# EAGLE design Load Switch (EAGLE 9.4.2)
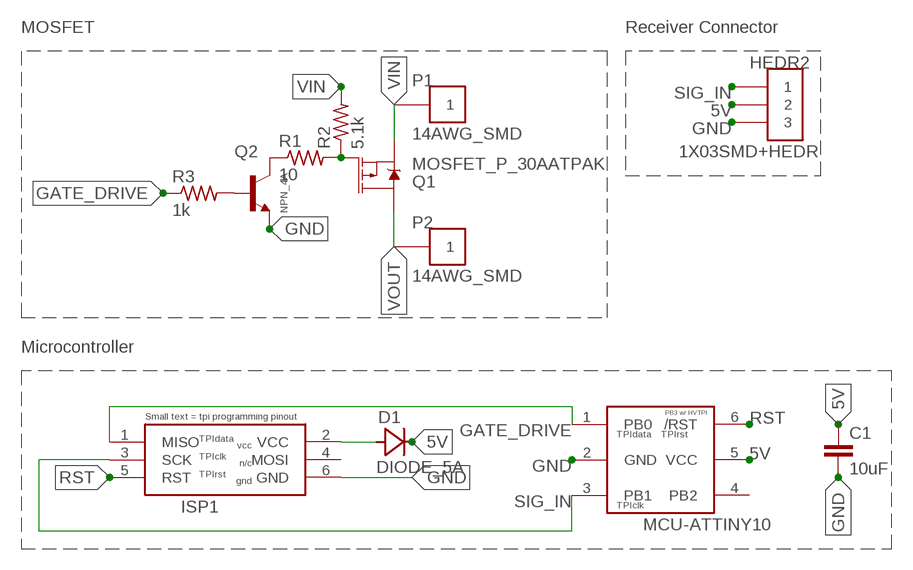
[diagram p0: schematic, sheet 1]

## Parts
C1  10uF  10UF-1206-6.3V-20%  [1206]
D1  DIODE_5A  [DO-214AC]
HEDR2  1X03SMD+HEDR  [1X3_SMD+HEDR]
IC1  MCU-ATTINY10  [SOT23-6]
ISP1  CON-ICSP/ISP-AVR-POGO  [2X3_POGO_AVR]
P1  14AWG_SMD  [14AWG_PAD]
P2  14AWG_SMD  [14AWG_PAD]
Q1  MOSFET_P_30AATPAK  [TO-252/DPAK]
Q2  NPN_4A  [SOT23-3]
R1  10  R_TG_0603  [TG-0603]
R2  5.1k  R_TG_0603  [TG-0603]
R3  1k  R_TG_0603  [TG-0603]

## Nets
5V: C1.1 D1.1(C) HEDR2.2 IC1.5(VCC)
GATE: Q2.3(C) R1.1
GATE_DRIVE: IC1.1(PB0) ISP1.1(MISO) R3.1
GND: C1.2 HEDR2.3 IC1.2(GND) ISP1.6(GND) Q2.2(E)
N$1: Q1.1(G) R1.2 R2.1
N$2: Q2.1(B) R3.2
N$3: D1.2(A) ISP1.2(VCC)
RST: IC1.6(/RST) ISP1.5(RST)
SIG_IN: HEDR2.1 IC1.3(PB1) ISP1.3(SCK)
VIN: P1.PAD Q1.3(S) R2.2
VOUT: P2.PAD Q1.2(D)
Unconnected: IC1.4(PB2) ISP1.4(MOSI)

## Notes on the sheet
- MOSFET | Receiver Connector
- Microcontroller

## Library data of the parts
C1 = SparkFun-Capacitors:10UF: 10.0µF ceramic capacitors A capacitor is a passive two-terminal electrical component used to store electrical energy temporarily in an electric field.; PROD_ID: CAP-10057
D1 = Diodes:DIODE_5A
HEDR2 = 0TG-Lib_v01.5:1X03
IC1 = 0TG-Lib_v01.5:MCU-ATTINY10: ATtiny4/5/9/10 8-bit Microcontroller with 512/1024 Bytes In-System Programmable Flash
ISP1 = 0TG-Lib_v01.5:CON-ICSP/ISP-AVR: AVR ISP HEADER Standard 6 pin header for AVR programming
P1 P2 = FPV_Static-Lib_v1.1:14AWG_SMD
Q1 = FPV_Static-Lib_v1.1:MOSFET_P_30A
Q2 = FPV_Static-Lib_v1.1:NPN_4A
R1-R3 = 0TG-Lib_v01.5:R_TG

## Board
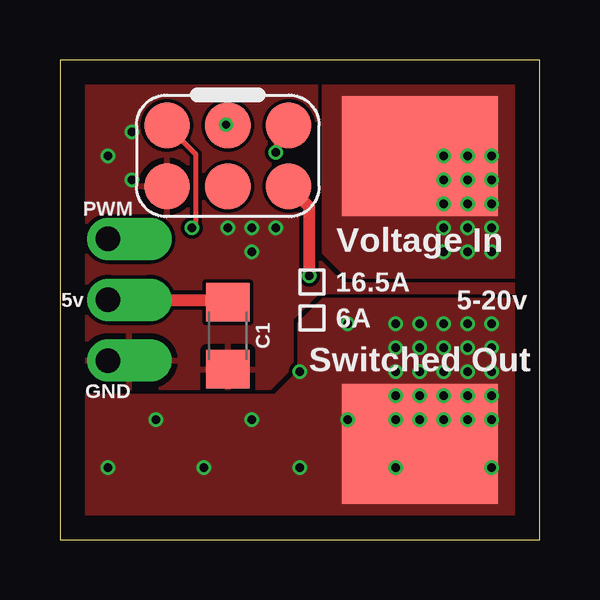
[diagram p1: board, top side]
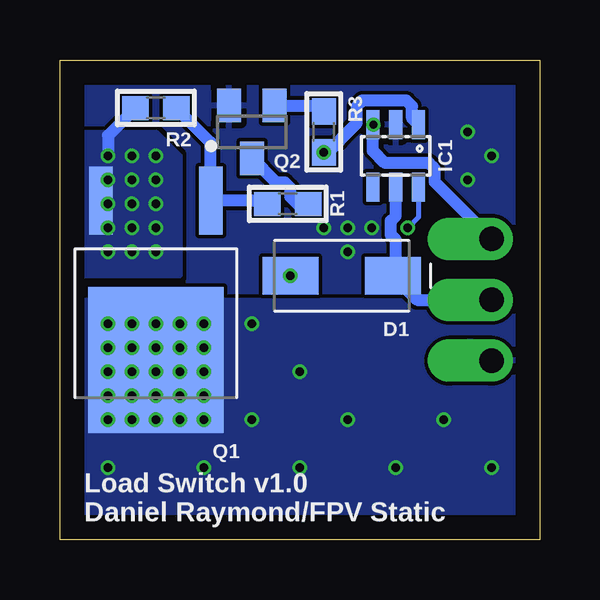
[diagram p2: board, bottom side, seen from below]

Size 20 x 20 mm. Coordinates in mm from the lower left corner, seen from the top.
Outline: 0,0 20,0 20,20 0,20 0,0
Copper layers (1*16): Top 0.035mm / dielectric 0.53mm / Bottom 0.035mm
Design rules "tg_jlc-special_via": minimum track width 0.195mm, minimum drill 0.2mm, track to track 6mil, track to pad 6mil, pad to pad 6mil, via to via 6mil, smd to smd 6mil, copper to edge 40mil, drill to drill 6mil, minimum pad ring 10mil, minimum via ring 0.125mm, stop-mask expansion 4mil, vias tented up to drill 10000mil, thermal gap 10mil

### Footprints (pad centres in the part's own frame; a part is rotated, then mirrored left to right if it is on the bottom)
1206 = smd 1.6 x 1.8: 1 -1.4,0; 2 1.4,0
DO-214AC = smd 2.33 x 1.56: 1 -2.14,0; 2 2.14,0
1X3_SMD+HEDR = drill 1.016 pad 1.778 offset: 1 -2.54,0; 2 0,0; 3 2.54,0
SOT23-6 = smd 0.55 x 1.2: 1 -0.95,-1.3; 2 0,-1.3; 3 0.95,-1.3; 4 0.95,1.3; 5 0,1.3; 6 -0.95,1.3
2X3_POGO_AVR = smd 1.905 x 1.905: 1 -2.54,-1.27; 2 -2.54,1.27; 3 0,-1.27; 4 0,1.27; 5 2.54,-1.27; 6 2.54,1.27
14AWG_PAD = smd 5 x 6.5: PAD 0,0
TO-252/DPAK = smd 0.97 x 2.83: 1 -2.29,-4.14; 3 2.29,-4.14 | smd 5.63 x 6.09: 2 0,2.51
SOT23-3 = smd 1 x 1.4: 1 -0.95,-1.1; 2 0.95,-1.1; 3 0,1.1
TG-0603 = smd 1.1 x 1: 1 -0.85,0; 2 0.85,0

### Placement (x,y rotation side)
C1  7,8.5 270 top
D1  8.25,11 180 bottom
HEDR2  2,10 270 top
IC1  6,16 180 bottom
ISP1  7,16 180 top
P1  15,16 90 top
P2  15,4 90 top
Q1  16,10 180 bottom
Q2  12,17 180 bottom
R1  10.5,14 180 bottom
R2  16,18 180 bottom
R3  9,17 90 bottom

### Tracks (layer width: path | path; a pad name or v marks a point on that pad's centre or on a via)
5V
  Top 0.5: HEDR2.2 6.9,10 C1.1
  Bottom 0.5: HEDR2.2 5.11,10 D1.1 6,11.11 6,12.51 6.2,12.71 6.2,13.29 6,13.49 IC1.5
GATE
  Bottom 0.5: R1.1 10.1,14 10.4,14.3 10.4,14.67 10.63,14.9 11,14.9 Q2.3
GATE_DRIVE  (via drill 0.35)
  Top 0.2: ISP1.1 9,16.73 R3.1
  Bottom 0.5: R3.1 9,16 7.63,17.37 7.63,18.07 7.39,18.3 5.56,18.3 5.32,18.07 5.32,17.57 IC1.1
  other vias: 9,16.15
GND  (via drill 0.35)
  other vias: 7,13 8,13 8,12 9,13 2,16 3,15 3,17
  pour Top (rank 2): 0,20 0,0 20,0 20,20
  pour Bottom (rank 2): 0,20 0,0 20,0 20,20
N$1
  Bottom 0.5: R2.1 13.71,16.56 Q1.1 11.99,14.14 R1.2
N$2
  Bottom 0.5: Q2.1 9.25,18.1 R3.2
N$3  (via drill 0.35)
  Top 0.5: ISP1.2 10.39,13.88 D1.2
  other vias: 10.39,11
RST  (via drill 0.35)
  Top 0.2: ISP1.5 5.67,16.07 5.67,13.16 v5.5,13
  Bottom 0.2: IC1.6 5.05,13.45 v5.5,13
SIG_IN  (via drill 0.35)
  Top 0.2: v6.92,17.3 6.97,17.3 ISP1.3
  Bottom 0.2: IC1.3 v6.92,17.3
  Bottom 0.5: HEDR2.1 4.37,14.91 4.37,15.47 4.61,15.7 6.44,15.7 6.95,16.21 IC1.3
VIN  (via drill 0.35)
  Bottom 0.5: R2.2 18,16.85 v18,16
  other vias: 16,12 16,13 16,14 16,15 16,16 17,16 17,15 17,14 17,13 17,12 18,12 18,13 18,14 18,15
  pour Top (no thermals): 11,20 11,12 12,11 20,11 20,20
  pour Bottom (no thermals): 19,17 16,17 15,16 15,11 19,11
VOUT  (via drill 0.35)
  other vias: 14,9 15,9 16,9 17,9 18,9 14,8 15,8 16,8 17,8 18,8 14,7 15,7 16,7 17,7 18,7 14,6 15,6 16,6 17,6 18,6 14,5 15,5 16,5 17,5 18,5 2,3 4,5 6,3 10,3 14,3 18,3 12,5 10,7 8,5 12,9
  pour Bottom (no thermals): 1,1 19,1 19,10 1,10
  pour Top (no thermals): 12,10 20,10 20,0 0,0 0,5 1,6 9,6 10,7 10,9 11,10

### Text on the board
bPlace: Load Switch v1.0 / Daniel Raymond/FPV Static
tNames: PWM | Voltage In | 16.5A | 5v | 5-20v | 6A | Switched Out | GND